# EAGLE design control_board (EAGLE 5.10)
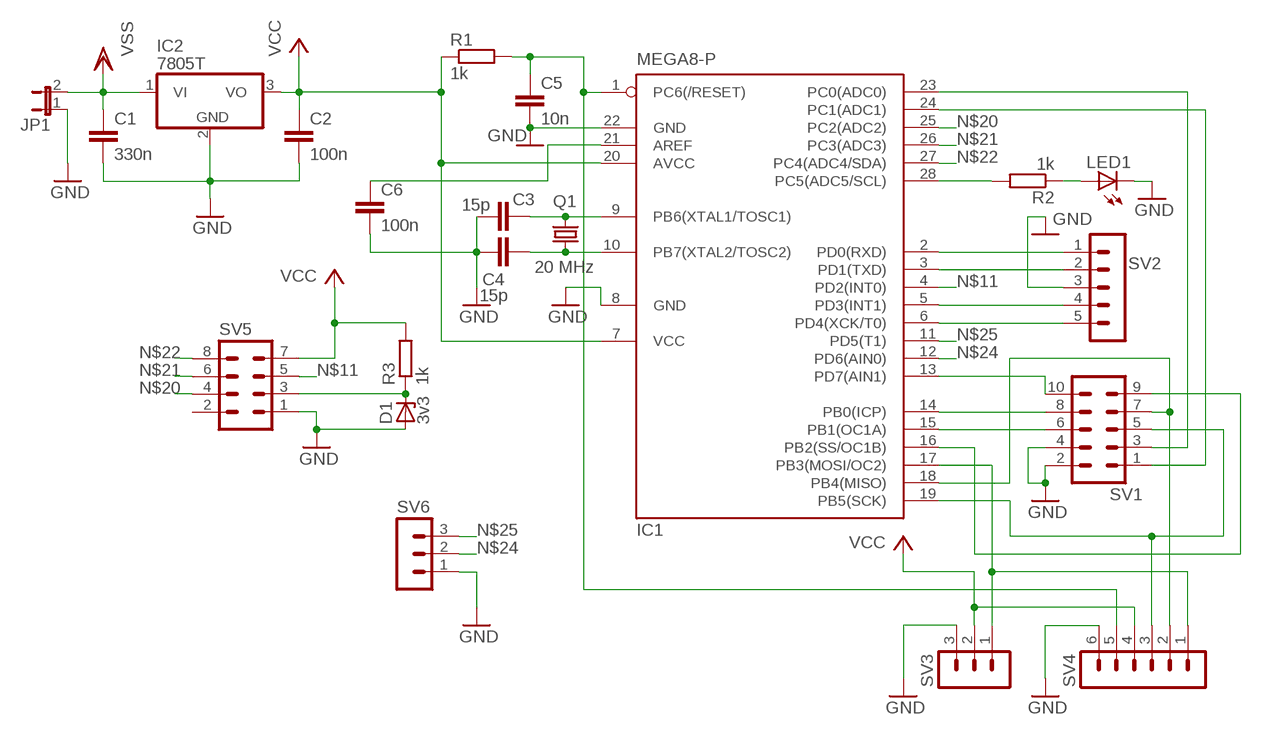
[diagram p0: schematic, sheet 1]

## Parts
C1  330n  C-EU050-025X075  [C050-025X075]
C2  100n  C-EU050-025X075  [C050-025X075]
C3  15p  C-EU050-025X075  [C050-025X075]
C4  15p  C-EU050-025X075  [C050-025X075]
C5  10n  C-EU050-025X075  [C050-025X075]
C6  100n  C-EU075-032X103  [C075-032X103]
D1  3v3  ZENER-DIODEZD-10  [ZDIO-10]
IC1  MEGA8-P  [DIL28-3]
IC2  7805T  [TO220H]
JP1  JP1E  [JP1]
LED1  LED3MM  [LED3MM]
Q1  20 MHz  CRYSTALHC49S  [HC49/S]
R1  1k  R-EU_0207/10  [0207/10]
R2  1k  R-EU_0207/10  [0207/10]
R3  1k  R-EU_0207/10  [0207/10]
SV1  MA05-2  [MA05-2]
SV2  MA05-1  [MA05-1]
SV3  MA03-1  [MA03-1]
SV4  MA06-1  [MA06-1]
SV5  MA04-2  [MA04-2]
SV6  MA03-1  [MA03-1]

## Nets
GND: C1.2 C2.2 C3.1 C4.1 C5.2 C6.2 D1.A IC1.8(GND) IC1.22(GND) IC2.2(GND) JP1.1 LED1.K(C) SV1.2 SV1.4 SV2.3 SV3.3 SV4.6 SV5.1 SV6.1
N$1: IC1.19(PB5(SCK)) SV1.5 SV4.3
N$2: IC1.13(PD7(AIN1)) SV1.10
N$3: IC1.2(PD0(RXD)) SV2.1
N$4: IC1.16(PB2(SS/OC1B)) SV1.9
N$5: IC1.14(PB0(ICP)) SV1.8
N$6: IC1.15(PB1(OC1A)) SV1.6
N$7: IC1.17(PB3(MOSI/OC2)) SV3.1 SV4.1
N$8: IC1.24(PC1(ADC1)) SV1.1
N$9: IC1.23(PC0(ADC0)) SV1.3
N$10: IC1.3(PD1(TXD)) SV2.2
N$11: IC1.4(PD2(INT0)) SV5.5
N$12: C5.1 IC1.1(PC6(/RESET)) R1.2 SV4.5
N$13: LED1.A R2.1
N$14: C4.2 IC1.10(PB7(XTAL2/TOSC2)) Q1.1
N$15: C3.2 IC1.9(PB6(XTAL1/TOSC1)) Q1.2
N$16: IC1.28(PC5(ADC5/SCL)) R2.2
N$17: IC1.18(PB4(MISO)) SV1.7 SV4.2
N$18: IC1.5(PD3(INT1)) SV2.4
N$19: IC1.6(PD4(XCK/T0)) SV2.5
N$20: IC1.25(PC2(ADC2)) SV5.4
N$21: IC1.26(PC3(ADC3)) SV5.6
N$22: IC1.27(PC4(ADC4/SDA)) SV5.8
N$23: D1.C R3.1 SV5.3
N$24: IC1.12(PD6(AIN0)) SV6.2
N$25: IC1.11(PD5(T1)) SV6.3
N$26: C6.1 IC1.21(AREF)
VCC: C2.1 IC1.7(VCC) IC1.20(AVCC) IC2.3(VO) R1.1 R3.2 SV3.2 SV4.4 SV5.7
VSS: C1.1 IC2.1(VI) JP1.2
Unconnected: SV5.2

## Library data of the parts
C1-C6 = rcl:C-EU: CAPACITOR, European symbol
D1 = diode:ZENER-DIODE: Z-Diode
IC1 = atmel:MEGA8-P: MICROCONTROLLER 8 Kbytes FLASH, 1 kbytes SRAM, 512 bytes EEPROM, USART, 4-channel 10 bit ADC, 2-channel 8 bit ADC Pin compatible with Atmega48, ATMega88, ATMega168 Source: avr.lbr
IC2 = linear:78*: Positive VOLTAGE REGULATOR Source: http://cache.national.com/ds/LM/LM78L05.pdf http://www.fairchildsemi.com/ds/LM/LM7805.pdf
JP1 = jumper:JP1E: JUMPER
LED1 = led:LED: LED OSRAM: - CHIPLED LG R971, LG N971, LY N971, LG Q971, LY Q971, LO R971, LY R971 LH N974, LH R974 LS Q976, LO Q976, LY Q976 LO Q996 - Hyper CHIPLED LW Q18S LB Q993, LB Q99A, LB R99A - SideLED LS A670, LO A670, LY A670, LG A670, LP A670 LB A673, LV A673, LT A673, LW A673 LH A674 LY A675 LS A676, LA A676, LO A676, LY A676, LW A676 LS A679, LY A679, LG A679 - Hyper Micro SIDELED® LS Y876, LA Y876, LO Y876, LY Y876 LT Y87S - SmartLED LW L88C, LW L88S LB L89C, LB L89S, LG L890 LS L89K, LO L89K, LY L89K LS L896, LA L896, LO L896, LY L896 - TOPLED LS T670, LO T670, LY T670, LG T670, LP T670 LSG T670, LSP T670, LSY T670, LOP T670, LYG T670 LG T671, LOG T671, LSG T671 LB T673, LV T673, LT T673, LW T673 LH T674 LS T676, LA T676, LO T676, LY T676, LB T676, LH T676, LSB T676, LW T676 LB T67C, LV T67C, LT T67C, LS T67K, LO T67K, LY T67K, LW E67C LS E67B, LA E67B, LO E67B, LY E67B, LB E67C, LV E67C, LT E67C LW T67C LS T679, LY T679, LG T679 LS T770, LO T770, LY T770, LG T770, LP T770 LB T773, LV T773, LT T773, LW T773 LH T774 LS E675, LA E675, LY E675, LS T675 LS T776, LA T776, LO T776, LY T776, LB T776 LHGB T686 LT T68C, LB T68C - Hyper Mini TOPLED® LB M676 - Mini TOPLED Santana® LG M470 LS M47K, LO M47K, LY M47K Source: http://www.osram.convergy.de LUXEON: - LUMILED® LXK2-PW12-R00, LXK2-PW12-S00, LXK2-PW14-U00, LXK2-PW14-V00 LXK2-PM12-R00, LXK2-PM12-S00, LXK2-PM14-U00 LXK2-PE12-Q00, LXK2-PE12-R00, LXK2-PE12-S00, LXK2-PE14-T00, LXK2-PE14-U00 LXK2-PB12-K00, LXK2-PB12-L00, LXK2-PB12-M00, LXK2-PB14-N00, LXK2-PB14-P00, LXK2-PB14-Q00 LXK2-PR12-L00, LXK2-PR12-M00, LXK2-PR14-Q00, LXK2-PR14-R00 LXK2-PD12-Q00, LXK2-PD12-R00, LXK2-PD12-S00 LXK2-PH12-R00, LXK2-PH12-S00 LXK2-PL12-P00, LXK2-PL12-Q00, LXK2-PL12-R00 Source: www.luxeon.com KINGBRIGHT: KA-3528ASYC Source: www.kingbright.com
Q1 = crystal:CRYSTAL: CRYSTAL
R1-R3 = rcl:R-EU_: RESISTOR, European symbol
SV1 = con-lstb:MA05-2: PIN HEADER
SV2 = con-lstb:MA05-1: PIN HEADER
SV3 SV6 = con-lstb:MA03-1: PIN HEADER
SV4 = con-lstb:MA06-1: PIN HEADER
SV5 = con-lstb:MA04-2: PIN HEADER

## Board
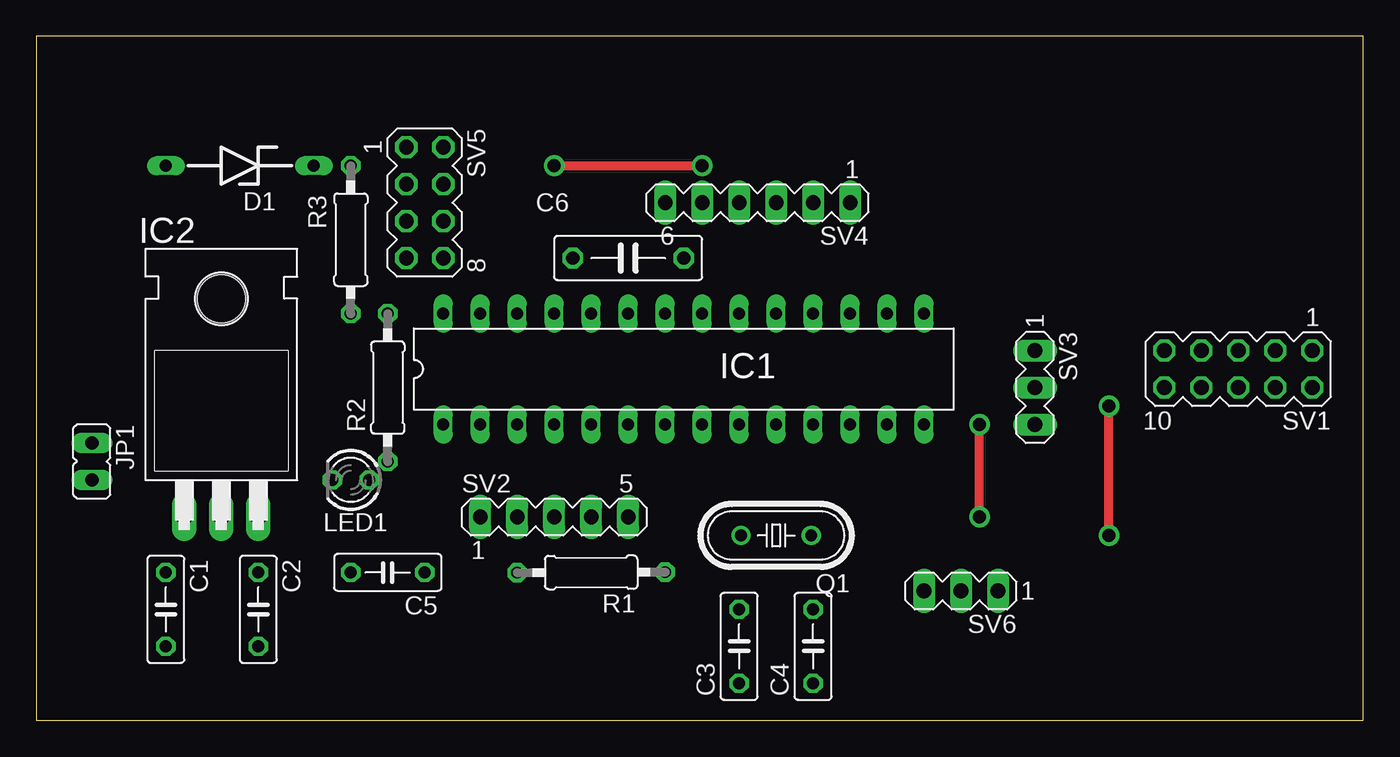
[diagram p1: board, top side]
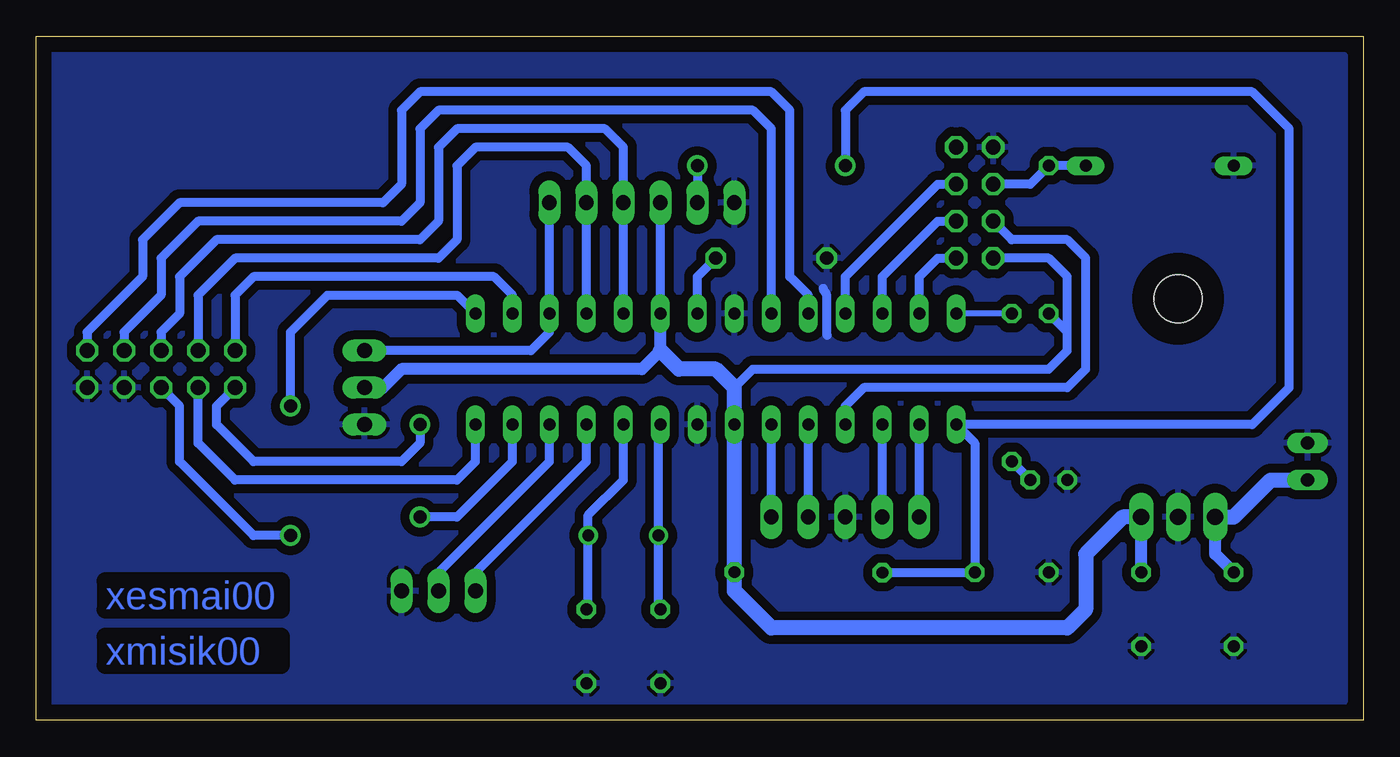
[diagram p2: board, bottom side, seen from below]

Size 91.11 x 46.98 mm. Coordinates in mm from the lower left corner, seen from the top.
Outline: 0,0 91.11,0 91.11,46.98 0,46.98 0,0
Copper layers (1*16): Top 0.035mm / dielectric 1.5mm / Bottom 0.035mm
Design rules "default": minimum track width 10mil, minimum drill 24mil, track to track 8mil, track to pad 8mil, pad to pad 8mil, via to via 8mil, smd to smd 8mil, copper to edge 40mil, drill to drill 8mil, minimum pad ring 10mil, minimum via ring 8mil, stop-mask expansion 4mil, vias tented up to drill 0mil, thermal gap 10mil

### Footprints (pad centres in the part's own frame; a part is rotated, then mirrored left to right if it is on the bottom)
C050-025X075 = drill 0.813 octagon: 1 -2.54,0; 2 2.54,0
C075-032X103 = drill 0.914 octagon: 1 -3.81,0; 2 3.81,0
ZDIO-10 = drill 0.813 long: A 5.08,0; C -5.08,0
DIL28-3 = drill 0.813 long: 1 -16.51,-3.81; 2 -13.97,-3.81; 3 -11.43,-3.81; 4 -8.89,-3.81; 5 -6.35,-3.81; 6 -3.81,-3.81; 7 -1.27,-3.81; 8 1.27,-3.81; 9 3.81,-3.81; 10 6.35,-3.81; 11 8.89,-3.81; 12 11.43,-3.81; 13 13.97,-3.81; 14 16.51,-3.81; 15 16.51,3.81; 16 13.97,3.81; 17 11.43,3.81; 18 8.89,3.81; 19 6.35,3.81; 20 3.81,3.81; 21 1.27,3.81; 22 -1.27,3.81; 23 -3.81,3.81; 24 -6.35,3.81; 25 -8.89,3.81; 26 -11.43,3.81; 27 -13.97,3.81; 28 -16.51,3.81
TO220H = drill 1.118 long: 1 -2.54,-10.16; 2 0,-10.16; 3 2.54,-10.16 | hole 3.302: 0,4.826
JP1 = drill 0.914 long: 1 0,-1.27; 2 0,1.27
LED3MM = drill 0.813 octagon: A -1.27,0; K 1.27,0
HC49/S = drill 0.813 round: 1 -2.413,0; 2 2.413,0
0207/10 = drill 0.813 octagon: 1 -5.08,0; 2 5.08,0
MA05-2 = drill 1.016 octagon: 1 -5.08,-1.27; 2 -5.08,1.27; 3 -2.54,-1.27; 4 -2.54,1.27; 5 0,-1.27; 6 0,1.27; 7 2.54,-1.27; 8 2.54,1.27; 9 5.08,-1.27; 10 5.08,1.27
MA05-1 = drill 1.016 long: 1 -5.08,0; 2 -2.54,0; 3 0,0; 4 2.54,0; 5 5.08,0
MA03-1 = drill 1.016 long: 1 -2.54,0; 2 0,0; 3 2.54,0
MA06-1 = drill 1.016 long: 1 -6.35,0; 2 -3.81,0; 3 -1.27,0; 4 1.27,0; 5 3.81,0; 6 6.35,0
MA04-2 = drill 1.016 octagon: 1 -3.81,-1.27; 2 -3.81,1.27; 3 -1.27,-1.27; 4 -1.27,1.27; 5 1.27,-1.27; 6 1.27,1.27; 7 3.81,-1.27; 8 3.81,1.27

### Placement (x,y rotation side)
C1  8.89,7.62 270 top
C2  15.24,7.62 270 top
C3  48.26,5.08 90 top
C4  53.34,5.08 90 top
C5  24.13,10.16 180 top
C6  40.64,31.75 180 top
D1  13.97,38.1 180 top
IC1  44.45,24.13 0 top
IC2  12.7,24.13 0 top
JP1  3.81,17.78 180 top
LED1  21.59,16.51 180 top
Q1  50.8,12.7 180 top
R1  38.1,10.16 180.2 top
R2  24.13,22.86 90 top
R3  21.59,33.02 270 top
SV1  82.55,24.13 180 top
SV2  35.56,13.97 0 top
SV3  68.58,22.86 270 top
SV4  49.53,35.56 180 top
SV5  26.67,35.56 270 top
SV6  63.5,8.89 180 top

### Tracks (layer width: path | path; a pad name or v marks a point on that pad's centre or on a via)
GND
  Bottom 0.61: 37.08,29.66 36.83,29.21 36.83,26.67 36.81,26.45
  pour Bottom (isolate 0.61): 1.27,45.72 1.27,1.27 90.17,1.27 90.17,45.72
N$1
  Bottom 0.61: SV1.5 82.55,26.67 81.28,27.94 81.28,30.48 78.74,33.02 64.77,33.02 63.5,34.29 63.5,39.37 62.23,40.64 52.07,40.64 50.8,39.37 SV4.3 IC1.19
N$2  (via drill 0.9 pad 1.42)
  Top 0.61: v64.77,13.97 v64.77,20.32
  Bottom 0.61: IC1.13 58.42,17.78 62.23,13.97 v64.77,13.97 | SV1.10 78.74,21.59 78.74,20.32 76.2,17.78 66.04,17.78 64.77,19.05 v64.77,20.32
N$3
  Bottom 0.61: SV2.1 IC1.2
N$4
  Bottom 0.61: SV1.9 77.47,29.21 76.2,30.48 59.69,30.48 58.42,29.21 IC1.16
N$5
  Bottom 0.61: IC1.14 60.96,17.78 62.23,16.51 77.47,16.51 80.01,19.05 SV1.8
N$6  (via drill 0.9 pad 1.42)
  Top 0.61: v73.66,12.7 v73.66,21.59
  Bottom 0.61: v73.66,21.59 73.66,26.67 71.12,29.21 62.23,29.21 IC1.15 | v73.66,12.7 76.2,12.7 81.28,17.78 81.28,21.59 SV1.6
N$7
  Bottom 0.61: SV3.1 57.15,25.4 55.88,26.67 IC1.17 SV4.1
N$8
  Bottom 0.61: SV1.1 87.63,26.67 83.82,30.48 83.82,33.02 81.28,35.56 67.31,35.56 66.04,36.83 66.04,41.91 64.77,43.18 40.64,43.18 39.37,41.91 39.37,30.48 38.1,29.21 IC1.24
N$9
  Bottom 0.61: SV1.3 85.09,26.67 82.55,29.21 82.55,31.75 80.01,34.29 66.04,34.29 64.77,35.56 64.77,40.64 63.5,41.91 41.91,41.91 40.64,40.64 IC1.23
N$10
  Bottom 0.61: SV2.2 IC1.3
N$11
  Bottom 0.61: IC1.4 35.56,21.59 34.29,22.86 20.32,22.86 19.05,24.13 19.05,31.75 20.32,33.02 24.13,33.02 SV5.5
N$12  (via drill 0.9 pad 1.42)
  Top 0.61: v35.56,38.1 v45.72,38.1
  Bottom 0.61: R1.2 26.69,10.14 C5.1 26.67,19.05 IC1.1 7.62,20.32 5.08,22.86 5.08,40.64 7.62,43.18 34.29,43.18 35.56,41.91 v35.56,38.1 | v45.72,38.1 SV4.5
N$13
  Bottom 0.61: LED1.A R2.1
N$14
  Bottom 0.61: IC1.10 50.8,16.51 53.21,14.1 Q1.1 53.21,7.75 C4.2
N$15
  Bottom 0.61: IC1.9 48.39,20.19 Q1.2 48.39,7.75 C3.2
N$16
  Bottom 0.406: R2.2 IC1.28
N$17
  Bottom 0.61: SV1.7 80.01,29.21 77.47,31.75 63.5,31.75 62.23,33.02 62.23,38.1 60.96,39.37 54.61,39.37 53.34,38.1 SV4.2 IC1.18
N$18
  Bottom 0.61: SV2.4 IC1.5
N$19
  Bottom 0.61: SV2.5 IC1.6
N$20
  Bottom 0.61: SV5.4 29.21,36.83 35.56,30.48 IC1.25
N$21
  Bottom 0.61: SV5.6 29.21,34.29 33.02,30.48 IC1.26
N$22
  Bottom 0.61: SV5.8 29.21,31.75 30.48,30.48 IC1.27
N$23
  Bottom 0.61: SV5.3 22.86,36.83 R3.1 D1.C
N$24
  Bottom 0.61: IC1.12 55.88,17.78 63.5,10.16 SV6.2
N$25
  Bottom 0.61: IC1.11 53.34,17.78 60.96,10.16 SV6.3
N$26
  Bottom 0.61: C6.1 45.72,30.48 IC1.21
VCC
  Bottom 0.61: 43.18,22.86 41.91,24.13 21.59,24.13 20.32,25.4 20.32,26.67 | 20.32,26.67 20.32,30.48 21.59,31.75 SV5.7 | 20.32,26.67 R3.2 | IC1.20 SV4.4
  Bottom 0.813: SV3.2 67.31,22.86 66.04,24.13 49.53,24.13 48.26,25.4 IC1.20 | C2.1 IC2.3
  Bottom 1.016: 48.26,25.4 46.99,24.13 44.45,24.13 43.18,22.86 IC1.7 R1.1 43.18,8.89 40.64,6.35 20.32,6.35 19.05,7.62 19.05,11.43 16.51,13.97 IC2.3
VSS
  Bottom 0.813: C1.1 10.16,11.43 IC2.1
  Bottom 1.016: JP1.2 6.35,16.51 8.89,13.97 IC2.1

### Text on the board
Bottom: xesmai00 | xmisik00